# Altium schematic sheet Power_Board.SchDoc: Power Stage
size C; DrawnBy: USU IFEC 2025; Revision: 1; SheetNumber: 1; SheetTotal: 5
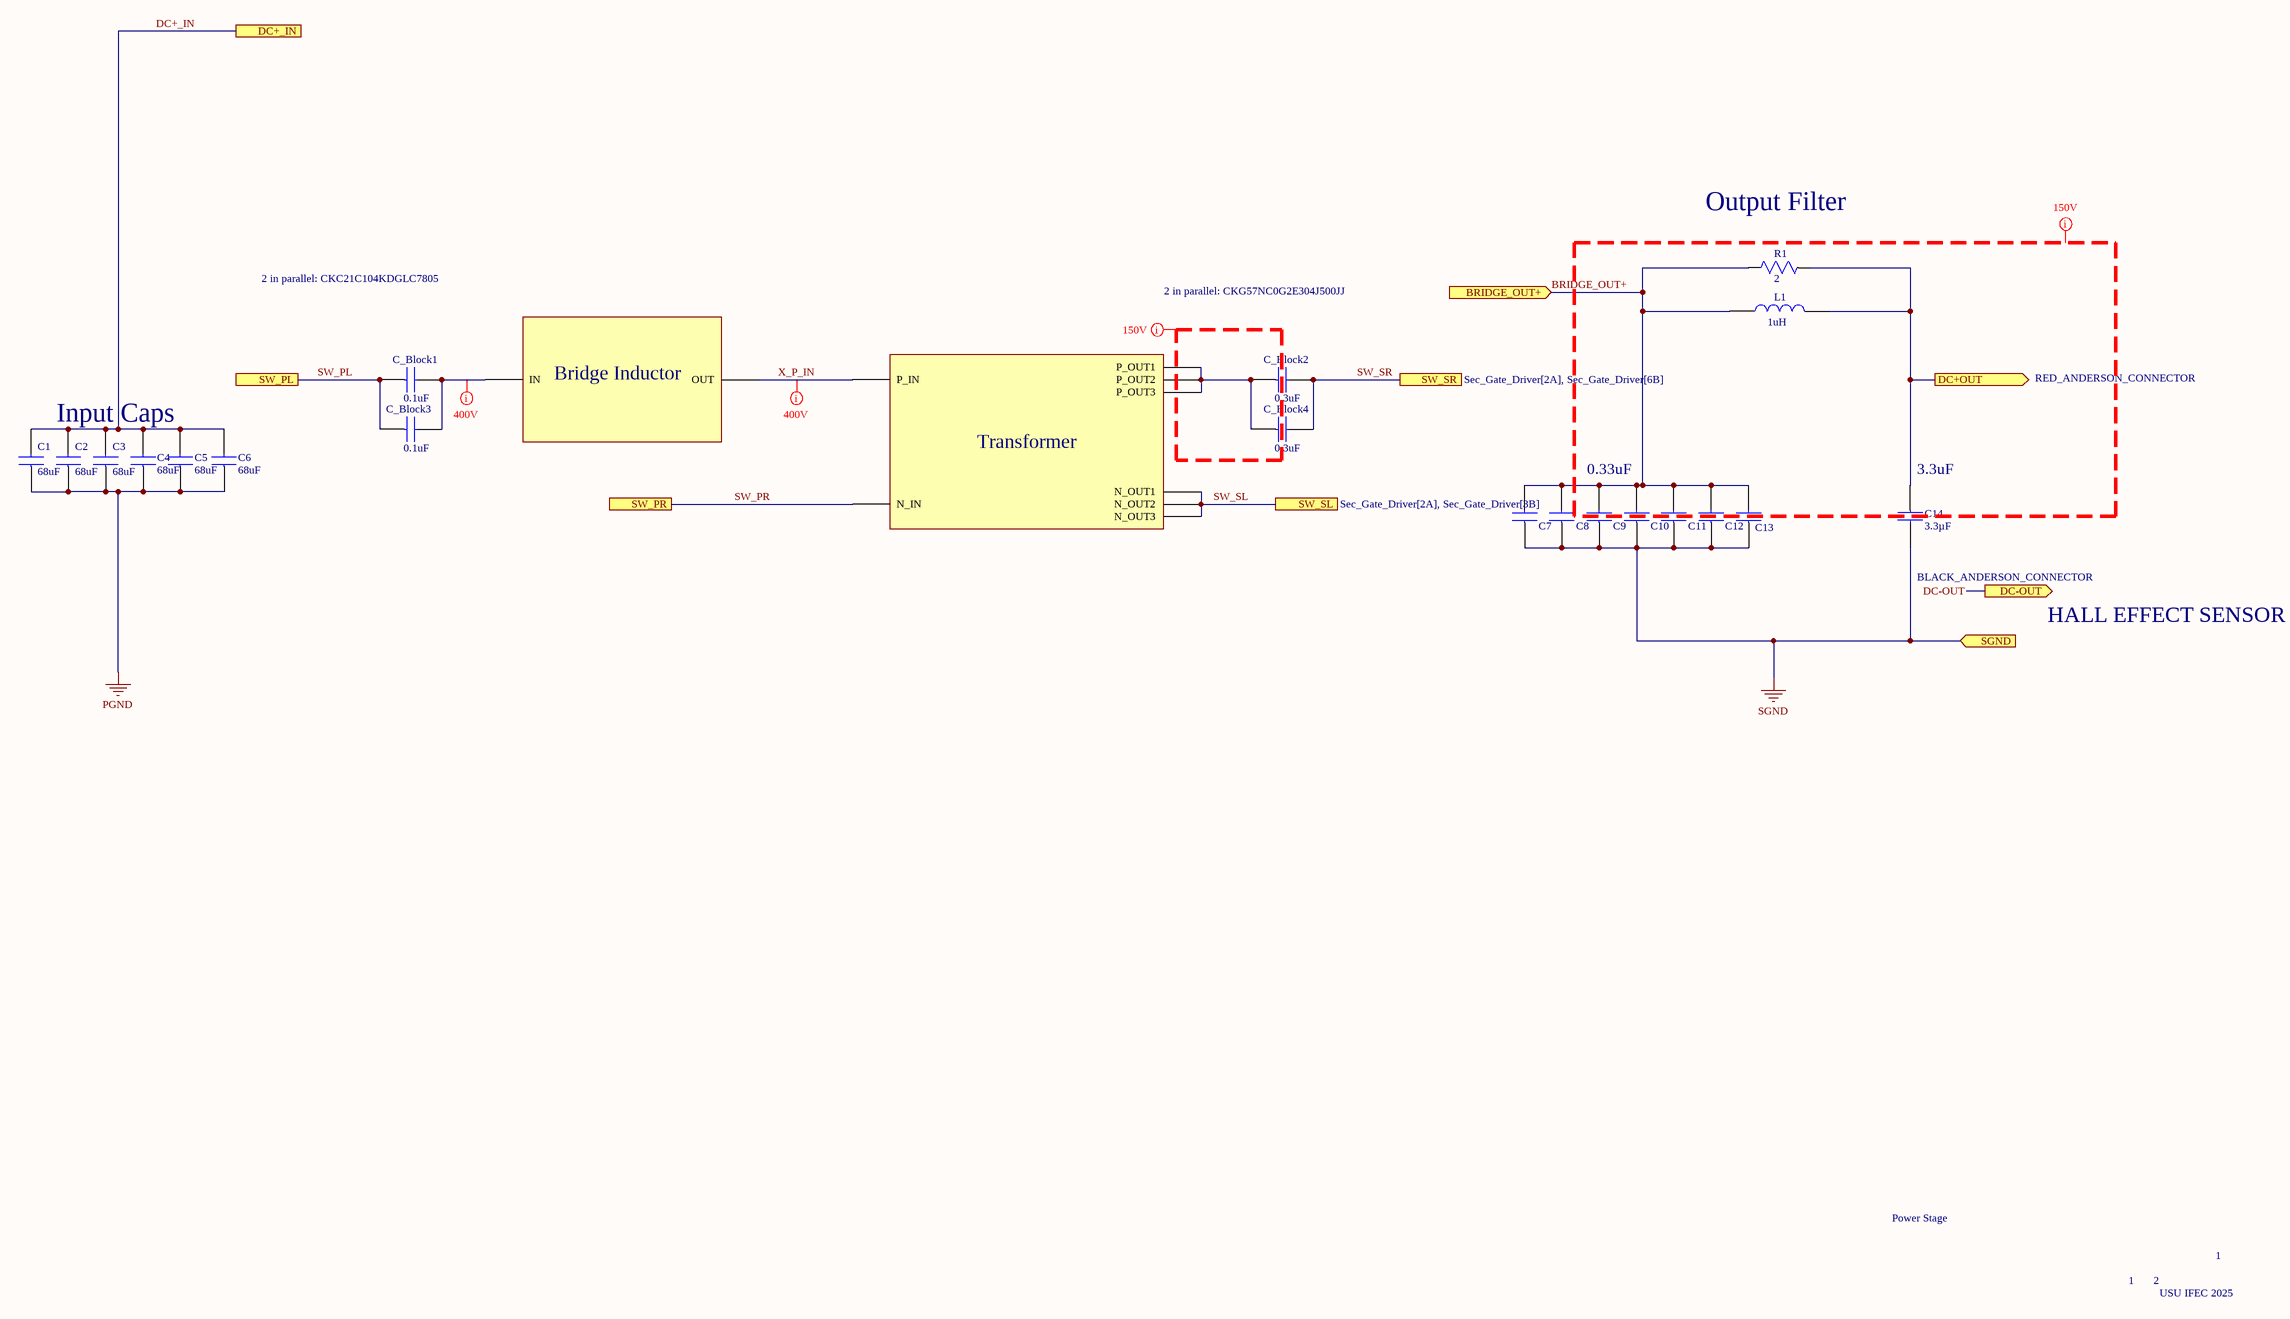
[diagram p0: Power_Board.SchDoc]

## Parts
C1  68uF  [CAP_L_18X20_RUB]
C2  68uF  [CAP_L_18X20_RUB]
C3  68uF  [CAP_L_18X20_RUB]
C4  68uF  [CAP_L_18X20_RUB]
C5  68uF  [CAP_L_18X20_RUB]
C6  68uF  [CAP_L_18X20_RUB]
C7  0.047uF  [C1206]  (value not drawn)
C8  0.047uF  [C1206]  (value not drawn)
C9  0.047uF  [C1206]  (value not drawn)
C10  0.047uF  [C1206]  (value not drawn)
C11  0.047uF  [C1206]  (value not drawn)
C12  0.047uF  [C1206]  (value not drawn)
C13  0.047uF  [C1206]  (value not drawn)
C14  3.3µF  [CAPC4632X300N]
C_Block1  0.1uF  [CAPC5777X540N]
C_Block2  0.3uF  [CAPC6050X550N]
C_Block3  0.1uF  [CAPC5777X540N]
C_Block4  0.3uF  [CAPC6050X550N]
L1  1uH  [INDPM7166X300N]
L_Bridge1  Bridge Inductor  [Bridge Inductor]  (value not drawn)
R1  2  [RESC6331X80N]
XFMR1  Transformer  [Transformer]  (value not drawn)

## Ports
BRIDGE_OUT+ (in, see Sec_Gate_Driver[3B], Sec_Gate_Driver[6B], Sensing[1C]), DC+_IN (see Aux_Power[1A], Pri_Gate_Driver[3B], Pri_Gate_Driver[6B]), DC+OUT (out), DC-OUT (out, see Sensing[1A]), SGND (in, see Sensing[1A]), SW_PL (see Pri_Gate_Driver[2A], Pri_Gate_Driver[3B]), SW_PR (see Pri_Gate_Driver[2A], Pri_Gate_Driver[6C]), SW_SL (see Sec_Gate_Driver[2A], Sec_Gate_Driver[3B]), SW_SR (see Sec_Gate_Driver[2A], Sec_Gate_Driver[6B])

## Nets
PGND: C1.1 C2.1 C3.1 C4.1 C5.1 C6.1
SGND: C7.1 C8.1 C9.1 C10.1 C11.1 C12.1 C13.1 C14.2 ; port SGND
BRIDGE_OUT+: C7.2 C8.2 C9.2 C10.2 C11.2 C12.2 C13.2 L1.1 R1.1 ; port BRIDGE_OUT+
DC+_IN: C1.2 C2.2 C3.2 C4.2 C5.2 C6.2 ; port DC+_IN
DC+OUT: C14.1 L1.2 R1.2 ; port DC+OUT
DC-OUT: port DC-OUT
SW_PL: C_Block1.1 C_Block3.1 ; port SW_PL
SW_PR: XFMR1.2(N_IN) ; port SW_PR
SW_SL: XFMR1.6(N_OUT1) XFMR1.7(N_OUT2) XFMR1.8(N_OUT3) ; port SW_SL
SW_SR: C_Block2.2 C_Block4.2 ; port SW_SR
X_P_IN: L_Bridge1.2(OUT) XFMR1.1(P_IN)
NetC_Block1_2: C_Block1.2 C_Block3.2 L_Bridge1.1(IN)
NetC_Block2_1: C_Block2.1 C_Block4.1 XFMR1.3(P_OUT1) XFMR1.4(P_OUT2) XFMR1.5(P_OUT3)

## Layout directives
net class 400V: NetC_Block1_2, X_P_IN
net class 150V: (no net found under the mark)

## Notes on the sheet
- Output Filter
- 2 in parallel: CKC21C104KDGLC7805
- 2 in parallel: CKG57NC0G2E304J500JJ
- Input Caps
- RED_ANDERSON_CONNECTOR
- 0.33uF
- (near C14) 3.3uF
- BLACK_ANDERSON_CONNECTOR
- HALL EFFECT SENSOR
- Power Stage
- 1
- 2
- USU IFEC 2025

## Library data of the parts
C1-C6 = 450LXW68MEFR18X20: CAP ALUM 68UF 20% 450V RADIAL TH; Mfr_Name: Rubycon
C7-C13 = C1206C473KCRACTU: CAP CER 0.047UF 500V X7R 1206; Manufacturer_Name: KEMET; Datasheet Link: https://content.kemet.com/datasheets/KEM_C1010_X7R_HV_SMD.pdf; Manufacturer_Part_Number: C1206C473KCRACTU; Mouser Part Number: 80-C1206C473KCRACTU; Mouser Price/Stock: https://www.mouser.co.uk/ProductDetail/KEMET/C1206C473KCRACTU?qs=INgPQyBKD9RtmtmwHhC%252BHg%3D%3D; Arrow Part Number: C1206C473KCRACTU; Arrow Price/Stock: https://www.arrow.com/en/products/c1206c473kcractu/kemet-corporation?region=nac
C14 = 885382211003: CUSTOM FOOTPRINT; Manufacturer_Name: Wurth Elektronik; Datasheet Link: https://www.we-online.com/components/products/datasheet/885382211003.pdf; Height: 3mm; Manufacturer_Part_Number: 885382211003; Mouser Part Number: 710-885382211003; Mouser Price/Stock: https://www.mouser.co.uk/ProductDetail/Wurth-Elektronik/885382211003?qs=1Kr7Jg1SGW8DZ1x19WIsng%3D%3D
C_Block1 C_Block3 = CKC21C104KDGLC7805: CAP CER 0.1UF 1KV C0G/NP0 2220; Manufacturer_Name: KEMET; Manufacturer_Part_Number: C1206C473KCRACTU; Datasheet Link: https://content.kemet.com/datasheets/KEM_C1010_X7R_HV_SMD.pdf; Mouser Part Number: 80-C1206C473KCRACTU; Mouser Price/Stock: https://www.mouser.co.uk/ProductDetail/KEMET/C1206C473KCRACTU?qs=INgPQyBKD9RtmtmwHhC%252BHg%3D%3D; Arrow Part Number: C1206C473KCRACTU; Arrow Price/Stock: https://www.arrow.com/en/products/c1206c473kcractu/kemet-corporation?region=nac
C_Block2 C_Block4 = CKG57NC0G2E304J500JJ: CAP CER 0.3UF 250V C0G/NP0 SMD; Manufacturer_Name: KEMET; Manufacturer_Part_Number: C1206C473KCRACTU; Datasheet Link: https://content.kemet.com/datasheets/KEM_C1010_X7R_HV_SMD.pdf; Mouser Part Number: 80-C1206C473KCRACTU; Mouser Price/Stock: https://www.mouser.co.uk/ProductDetail/KEMET/C1206C473KCRACTU?qs=INgPQyBKD9RtmtmwHhC%252BHg%3D%3D; Arrow Part Number: C1206C473KCRACTU; Arrow Price/Stock: https://www.arrow.com/en/products/c1206c473kcractu/kemet-corporation?region=nac
L1 = ECS-MPIL0630-1R0MC: FIXED IND 1UH 15A 9.2 MOHM SMD; Manufacturer_Name: ECS; Datasheet Link: https://www.arrow.com/en/products/ecs-mpil0630-1r0mc/ecs-international; Height: 3mm; Manufacturer_Part_Number: ECS-MPIL0630-1R0MC; Mouser Part Number: 520-MPIL0630-1R0MC; Mouser Price/Stock: https://www.mouser.co.uk/ProductDetail/ECS/ECS-MPIL0630-1R0MC?qs=wd5RIQLrsJiowQ97SXRcSA%3D%3D; Arrow Part Number: ECS-MPIL0630-1R0MC; Arrow Price/Stock: https://www.arrow.com/en/products/ecs-mpil0630-1r0mc/ecs-international?region=nac
R1 = CRM2512-FX-2R00ELF: 2 Ohms ±1% 2W Chip Resistor 2512 (6432 Metric) Current Sense Thick Film; Manufacturer_Name: Bourns; Datasheet Link: http://www.bourns.com/data/global/pdfs/CRM0805_1206_2010.pdf; Height: 0.8mm; Manufacturer_Part_Number: CRM2512-FX-2R00ELF; Mouser Part Number: 652-CRM2512FX2R00ELF; Mouser Price/Stock: https://www.mouser.co.uk/ProductDetail/Bourns/CRM2512-FX-2R00ELF?qs=HVbQlW5zcXVCtwHYCPbC1g%3D%3D; Arrow Part Number: CRM2512-FX-2R00ELF; Arrow Price/Stock: https://www.arrow.com/en/products/crm2512-fx-2r00elf/bourns?region=nac